# EasyEDA schematic SCH_occitel_mini.json
TITLE: Occitel Mini with ATmega32U4 Pro Micro; REV: 1.0; Date: 2021-08-26; Sheet: 1/1; Drawn By: BEN*.*; Company: Silicium
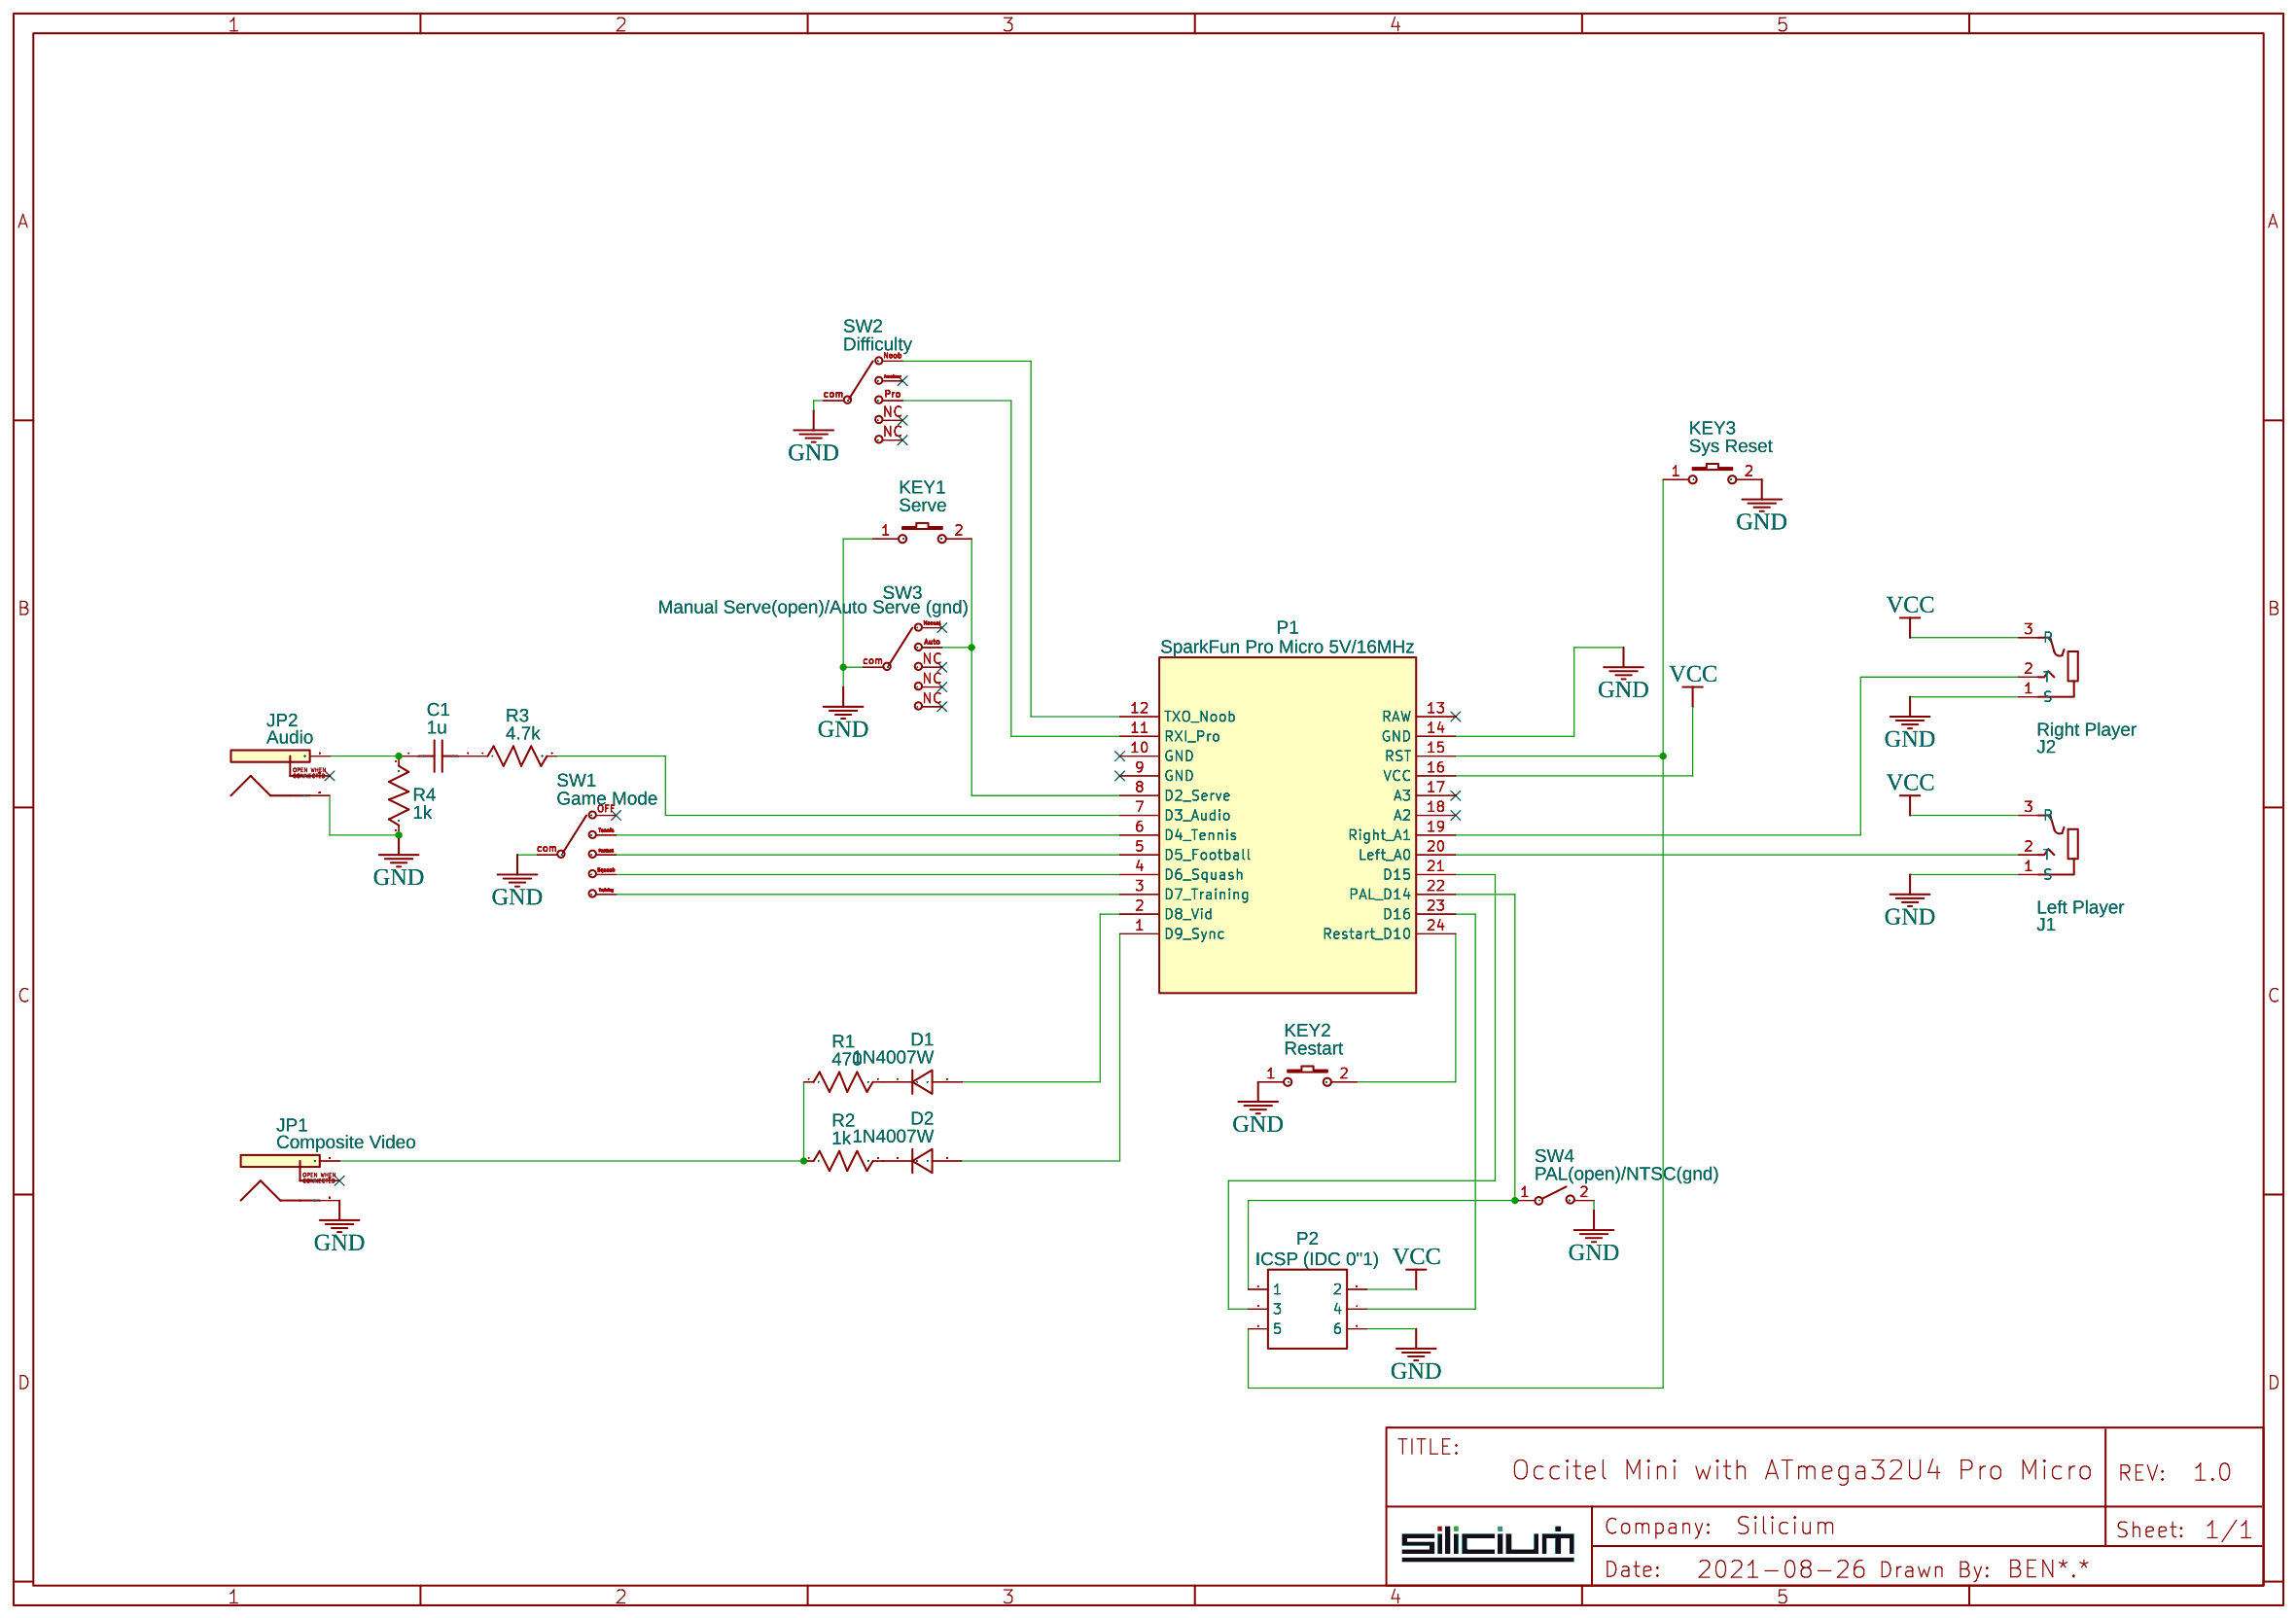
[diagram p0: schematic sheet]

## Parts
C1  1u  [C0603]
D1  1N4007W  [SOD-123_L2.8-W1.8-LS3.7-RD]
D2  1N4007W  [SOD-123_L2.8-W1.8-LS3.7-RD]
J1  Left Player  [JACK_3.5_PJ313D-SMT]
J2  Right Player  [JACK_3.5_PJ313D-SMT]
JP1  Composite Video  [RCA_LOCK]
JP2  Audio  [RCA_LOCK]
KEY1  Serve  [SW_PUSH_SMALL]
KEY2  Restart  [SW_PUSH_SMALL]
KEY3  Sys Reset  [SW_PUSH_SMALL]
P1  SparkFun Pro Micro 5V/16MHz  [PRO MICRO - 5V]
P2  ICSP (IDC 0"1)  [IDC-TH_6P-P2.54_C11214]
R1  470  [R0603]
R2  1k  [R0603]
R3  4.7k  [R0603]
R4  1k  [R0603]
SW1  Game Mode  [SP4T SLIDE SWITCH]
SW2  Difficulty  [SP4T SLIDE SWITCH]
SW3  Manual Serve(open)/Auto Serve (gnd)  [SP4T SLIDE SWITCH]
SW4  PAL(open)/NTSC(gnd)  [SW_SPDT]

## Library data of the parts
C1 = C_0603_US: Contributor: LCEDA_Lib
D1 D2 = 1N4007W: Supplier: LCSC; Supplier Part: C328592; Manufacturer: BLUE ROCKET; Contributor: LCEDA_Lib
J1 J2 = Jack_3.5mm_3pin: Package Display: No
JP1 JP2 = RCA-LOCK: Contributor: SparkFun
KEY1-KEY3 = K2-3.6×6.1_SMD: Supplier Part: C118141; Supplier: LCSC; Manufacturer Part: K2-1107ST-A4SW-06; Contributor: LCEDA_Lib; 制造商: 韩国韩荣
P1 = Pro Micro - 5V: sourceId: 1T5FDZYC8
P2 = HDR-IDC-2.54-2X3P: Supplier: LCSC; Manufacturer: BOOMELE; Manufacturer Part: 2X3 2.54mm IDC Box; image: //image.lceda.cn/szlcsc/C11214.jpg; Supplier Part: C11214
R1-R4 = R_0603_US: Contributor: LCEDA_Lib
SW1-SW3 = SW_SP5T: Contributor: Eugenia Grosso; license: https://www.gnu.org/licenses/lgpl-2.1.html
SW4 = SW_SPST: Contributor: KiCAD; license: https://www.gnu.org/licenses/lgpl-2.1.html

## Nets
GND: J1.1(S) J2.1(S) JP1.SHELL JP2.SHELL KEY1.1 KEY2.1 KEY3.2 P1.14(GND) P2.6 R4.1 SW1.com(3) SW2.com(3) SW3.com(3) SW4.2(B)
VCC: J1.3(R) J2.3(R) P1.16(VCC) P2.2
Net-(C1-1): C1.1 JP2.PIN R4.2
Net-(C1-2): C1.2 R3.1
Net-(D1-1): D1.1 R1.2
Net-(D1-2): D1.2 P1.2(D8 Vid)
Net-(D2-1): D2.1 R2.2
Net-(D2-2): D2.2 P1.1(D9 Sync)
Net-(J1-2): J1.2(T) P1.20(Left A0)
Net-(J2-2): J2.2(T) P1.19(Right A1)
Net-(JP1-PIN): JP1.PIN R1.1 R2.1
Net-(KEY1-2): KEY1.2 P1.8(D2 Serve) SW3.Auto(2)
Net-(KEY2-2): KEY2.2 P1.24(Restart D10)
Net-(KEY3-1): KEY3.1 P1.15(RST) P2.5
Net-(P1-3): P1.3(D7 Training) SW1.Training(4)
Net-(P1-4): P1.4(D6 Squash) SW1.Squash(4)
Net-(P1-5): P1.5(D5 Football) SW1.Football(4)
Net-(P1-6): P1.6(D4 Tennis) SW1.Tennis(2)
Net-(P1-7): P1.7(D3 Audio) R3.2
Net-(P1-11): P1.11(RXI Pro) SW2.Pro(4)
Net-(P1-12): P1.12(TXO Noob) SW2.Noob(1)
Net-(P1-21): P1.21(D15) P2.3
Net-(P1-22): P1.22(PAL D14) P2.1 SW4.1(A)
Net-(P1-23): P1.23(D16) P2.4

Not connected (* = marked no-connect by the designer): JP1 SWITCH*; JP2 SWITCH*; P1 9(GND)* 10(GND)* 13(RAW)* 17(A3)* 18(A2)*; SW1 OFF(1)*; SW2 Amateur(2)* NC(4)*; SW3 Manual(1)* NC(4)*
